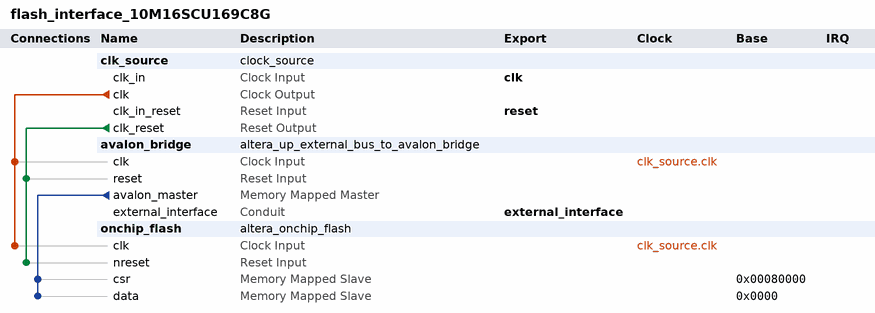
[diagram p0: system contents]
# Platform Designer (Qsys) system flash_interface_10M16SCU169C8G, MAX 10 10M16SCU169C8G
# Parameters at their usual value, and those the tool derives, are not listed.
package require -exact qsys 22.1
create_system flash_interface_10M16SCU169C8G
set_project_property DEVICE_FAMILY {MAX 10}
set_project_property DEVICE 10M16SCU169C8G

add_instance clk_source clock_source 22.1
set_instance_parameter_value clk_source clockFrequency 25000000

add_instance avalon_bridge altera_up_external_bus_to_avalon_bridge 18.0
set_instance_parameter_value avalon_bridge addr_size 16
set_instance_parameter_value avalon_bridge addr_size_multiplier Mbytes
set_instance_parameter_value avalon_bridge data_size 32

add_instance onchip_flash altera_onchip_flash 22.1
set_instance_parameter_value onchip_flash CLOCK_FREQUENCY 25.0
set_instance_parameter_value onchip_flash CONFIGURATION_MODE {Single Compressed Image}
set_instance_parameter_value onchip_flash SECTOR_ACCESS_MODE {Read and write,Read and write,Hidden,Read and write,Read and write}
set_instance_parameter_value onchip_flash initFlashContent false
set_instance_parameter_value onchip_flash initializationFileName altera_onchip_flash.hex
set_instance_parameter_value onchip_flash useNonDefaultInitFile false

# connections
add_connection clk_source.clk avalon_bridge.clk clock
add_connection clk_source.clk onchip_flash.clk clock
add_connection clk_source.clk_reset avalon_bridge.reset reset
add_connection clk_source.clk_reset onchip_flash.nreset reset
add_connection avalon_bridge.avalon_master onchip_flash.csr avalon
set_connection_parameter_value avalon_bridge.avalon_master/onchip_flash.csr baseAddress 0x00080000
add_connection avalon_bridge.avalon_master onchip_flash.data avalon
set_connection_parameter_value avalon_bridge.avalon_master/onchip_flash.data baseAddress 0x0000

# exported interfaces
add_interface clk clock sink
set_interface_property clk EXPORT_OF clk_source.clk_in
add_interface external_interface conduit end
set_interface_property external_interface EXPORT_OF avalon_bridge.external_interface
add_interface reset reset sink
set_interface_property reset EXPORT_OF clk_source.clk_in_reset

set_interconnect_requirement {$system} qsys_mm.clockCrossingAdapter AUTO
set_interconnect_requirement {$system} qsys_mm.enableEccProtection FALSE
set_interconnect_requirement {$system} qsys_mm.insertDefaultSlave FALSE
set_interconnect_requirement {$system} qsys_mm.maxAdditionalLatency 1

save_system flash_interface_10M16SCU169C8G.qsys
